# Altium project MD015A.PrjPcb (part 1 of 3)
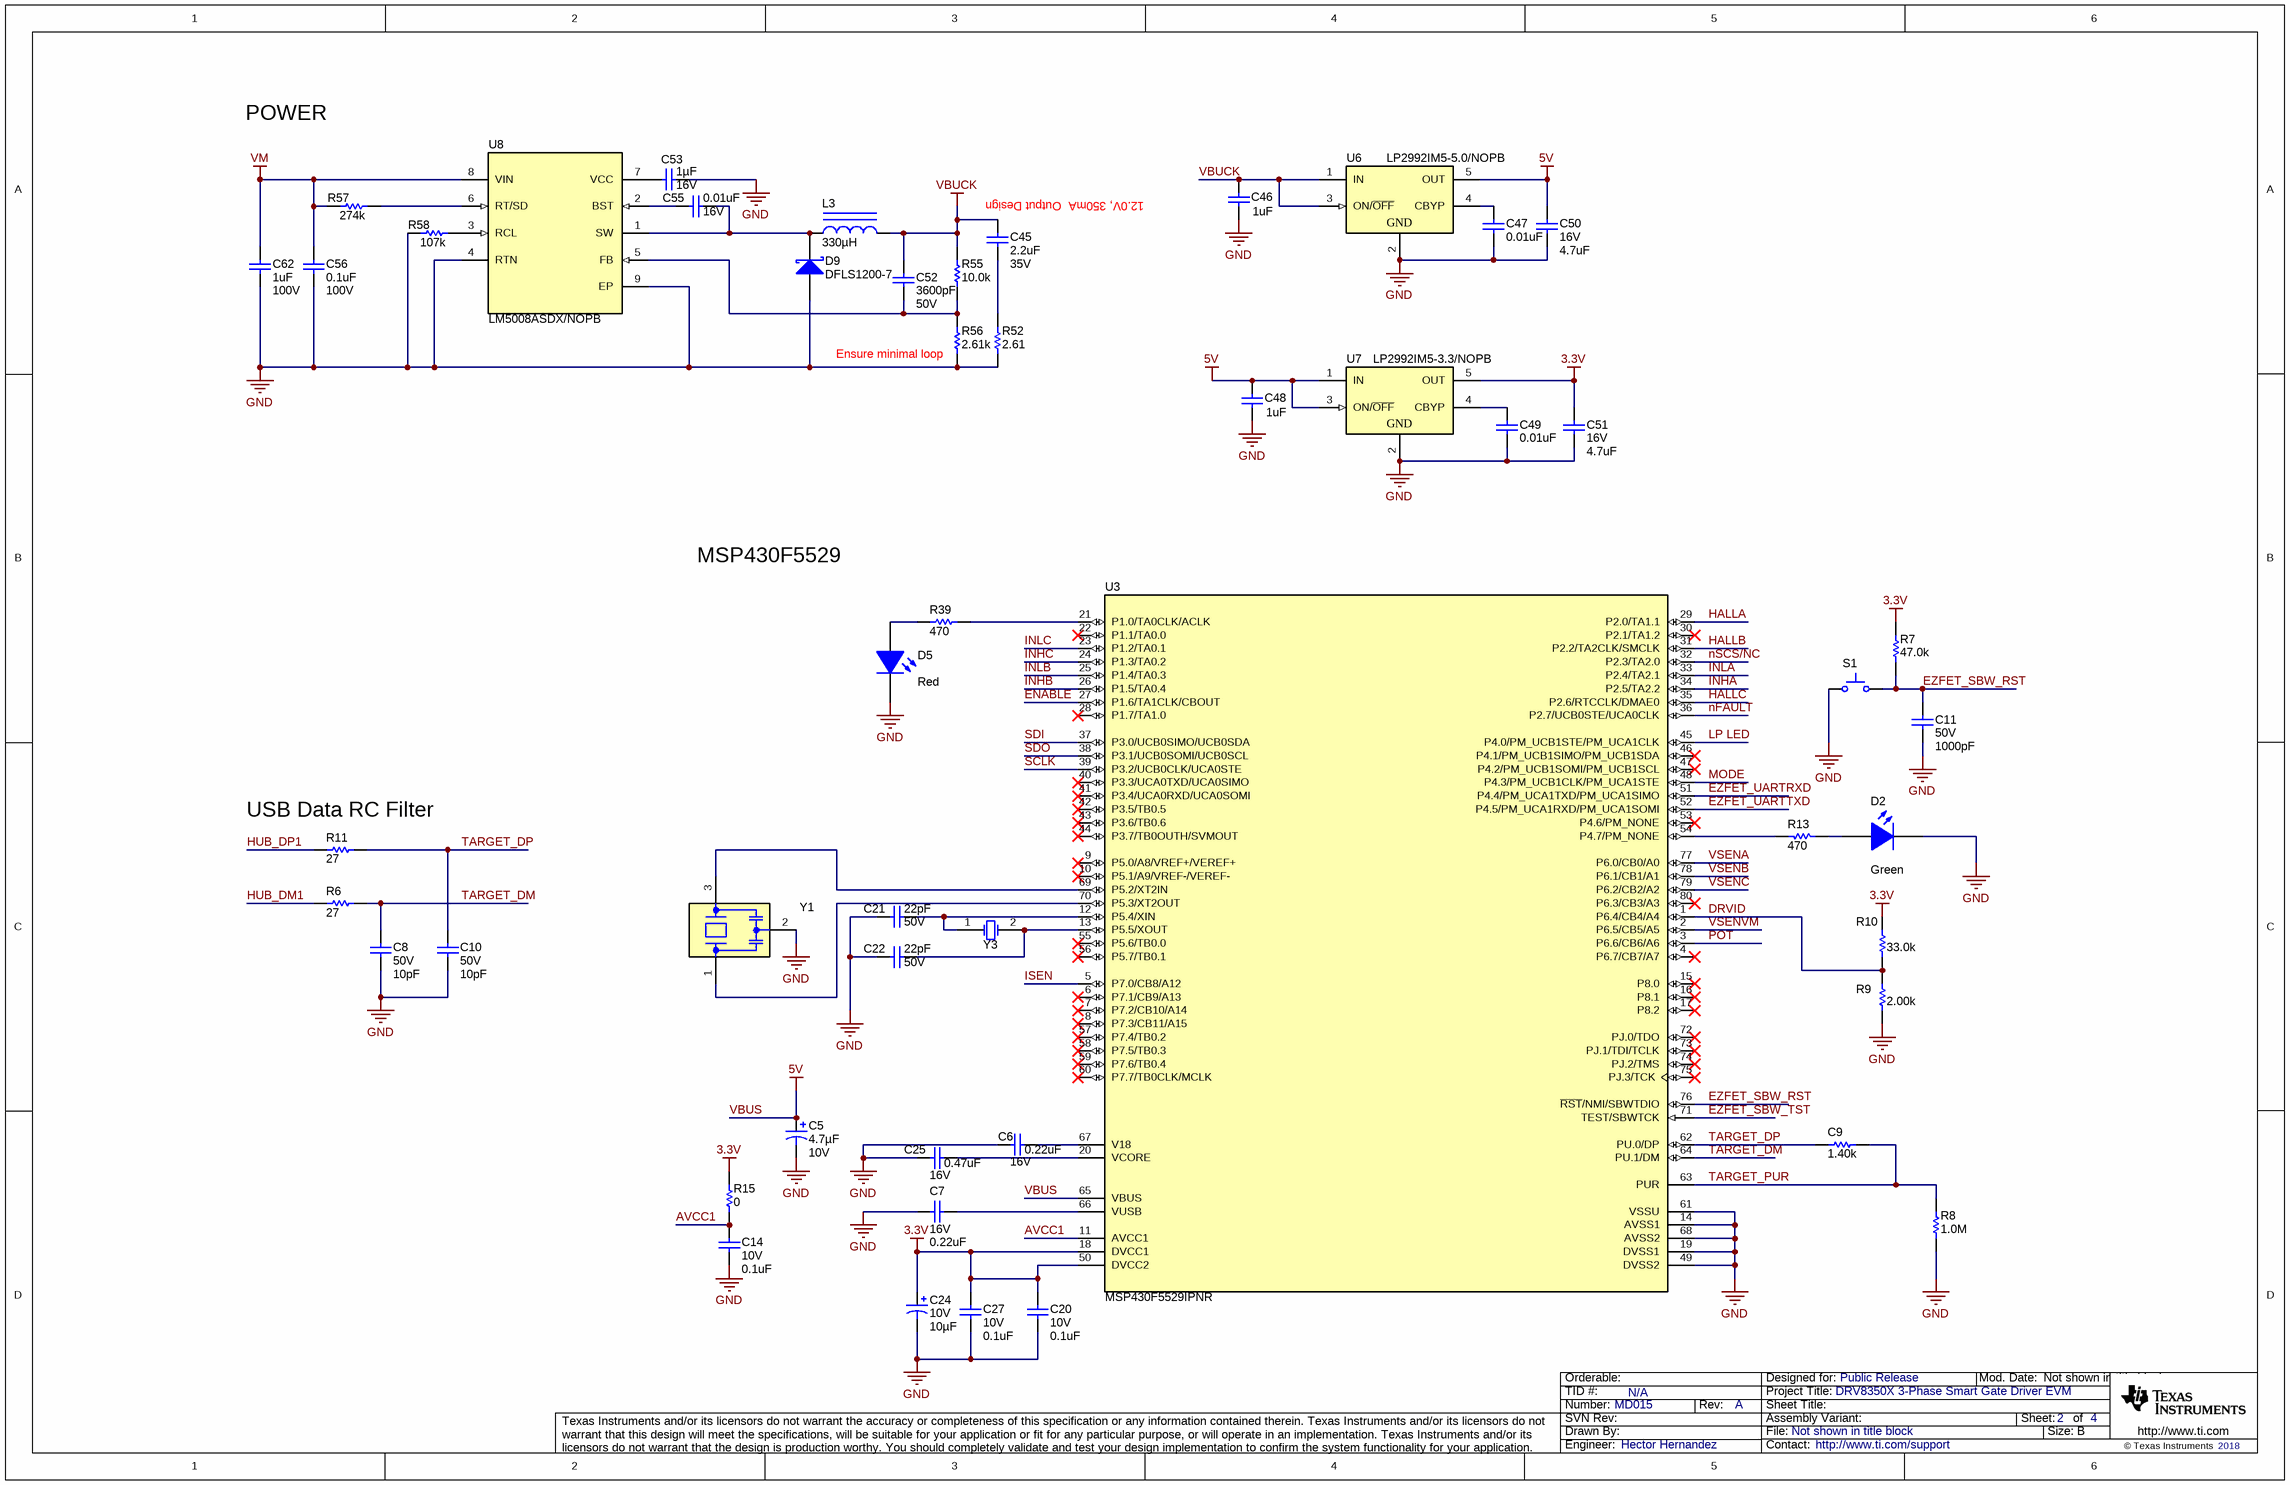
[diagram p0: MD015A_MCU_F5529.SchDoc]
CopyrightYear: 2018; PCB_Layout: Hector Hernandez; PCB_Rev: A; PRJ_Customer: Public Release; PRJ_Engineer: Hector Hernandez; PRJ_Number: MD015; PRJ_Title: DRV8350X 3-Phase Smart Gate Driver EVM; SCH_Rev: A; TechSupport: http://www.ti.com/support; TID: N/A
4 sheets, 249 parts. Net scope: global (net labels, ports and power ports of the same name join across sheets).
Board file: MD015A.PcbDoc
Sheets:
  MD015A_MCU_F5529.SchDoc
  MD015A_Hardware.SchDoc
  MD015A.SchDoc
  MD015A_MCU_USB2HUB.SchDoc

## Sheet MD015A_MCU_F5529.SchDoc
size 431 x 279 mm; Date: Not shown in title block; ApprovedBy: Not shown in title block; CheckedBy: Not shown in title block; Author: Not shown in title block; CompanyName: Not shown in title block; Engineer: Not shown in title block; Organization: Not shown in title block; Address1: Not shown in title block; Address2: Not shown in title block; Address3: Not shown in title block; Address4: Not shown in title block; DocumentNumber: 2; Revision: Use project parameter SCH_Rev; SheetNumber: 2; SheetTotal: 4; PageSetup: Record=PageOptions|CenterHorizontal=True|CenterVertical=True|PrintScale=1.00|XCorrection=1.00|YCorrection=1.00|PrintKind=0|BorderSize=5000000|LeftOffset=0|BottomOffset=0|Orientation=2|PaperLength=1000|PaperWidth=1000|Scale=100|PaperSource=15|PrintQuality=600|MediaType=1|DitherType=10|PaperKind=Letter|PrintScaleMode=1; CurrentTime: Not shown in title block; CurrentDate: Not shown in title block; Time: Not shown in title block; DocumentFullPathAndName: Not shown in title block; DocumentName: Not shown in title block; ModifiedDate: Not shown in title block; ImagePath: Not shown in title block

### Parts
C5  ValueDisplayed: 4.7µF  VDC_V: 10V  [3216-18]  (hidden comment: T55A475M010C0500)
C6  VDC_V: 16V  ValueDisplayed: 0.22uF  [0402L]  (hidden comment: C1005X5R1C224K050BB)
C7  VDC_V: 16V  ValueDisplayed: 0.22uF  [0402L]  (hidden comment: C1005X5R1C224K050BB)
C8  VDC_V: 50V  ValueDisplayed: 10pF  [0402L]  (hidden comment: 500R07S100JV4T)
C9  ValueDisplayed: 1.40k  [0402L]  (hidden comment: ERJ-2RKF1401X)
C10  VDC_V: 50V  ValueDisplayed: 10pF  [0402L]  (hidden comment: 500R07S100JV4T)
C11  VDC_V: 50V  ValueDisplayed: 1000pF  [0402L]  (hidden comment: 885012205061)
C14  VDC_V: 10V  ValueDisplayed: 0.1uF  [0402L]  (hidden comment: 885012105010)
C20  VDC_V: 10V  ValueDisplayed: 0.1uF  [0402L]  (hidden comment: 885012105010)
C21  VDC_V: 50V  ValueDisplayed: 22pF  [0402L]  (hidden comment: C1005C0G1H220J050BA)
C22  VDC_V: 50V  ValueDisplayed: 22pF  [0402L]  (hidden comment: C1005C0G1H220J050BA)
C24  VDC_V: 10V  ValueDisplayed: 10µF  [3216-18]  (hidden comment: T520A106M010ATE080)
C25  VDC_V: 16V  ValueDisplayed: 0.47uF  [0603L]  (hidden comment: GCM188R71C474KA55D)
C27  VDC_V: 10V  ValueDisplayed: 0.1uF  [0402L]  (hidden comment: 885012105010)
C45  ValueDisplayed: 2.2uF  VDC_V: 35V  [0805L]  (hidden comment: C2012X7R1V225K085AC)
C46  ValueDisplayed: 1uF  [0805L]  (hidden comment: CL21B105KBFNNNE)
C47  ValueDisplayed: 0.01uF  [0603L]  (hidden comment: C0603C103K4RACTU)
C48  ValueDisplayed: 1uF  [0805L]  (hidden comment: CL21B105KBFNNNE)
C49  ValueDisplayed: 0.01uF  [0603L]  (hidden comment: C0603C103K4RACTU)
C50  VDC_V: 16V  ValueDisplayed: 4.7uF  [0805L]  (hidden comment: GRM21BR71C475KA73L)
C51  VDC_V: 16V  ValueDisplayed: 4.7uF  [0805L]  (hidden comment: GRM21BR71C475KA73L)
C52  ValueDisplayed: 3600pF  VDC_V: 50V  [0603L]  (hidden comment: GRM1885C1H362JA01D)
C53  VDC_V: 16V  ValueDisplayed: 1µF  [0603]  (hidden comment: CL10B105KO8VPNC)
C55  ValueDisplayed: 0.01uF  VDC_V: 16V  [0603L]  (hidden comment: C0603C103K4RACTU)
C56  ValueDisplayed: 0.1uF  VDC_V: 100V  [0805_HV]  (hidden comment: C2012X7R2A104K125AA)
C62  ValueDisplayed: 1uF  VDC_V: 100V  [1206_180]  (hidden comment: CL31B105KCHNNNE)
D2  value Green  [LED_LTST-C190]  (hidden comment: LTST-C190GKT)
D5  value Red  [LED_LTST-C190_Red]  (hidden comment: LTST-C190CKT)
D9  DFLS1200-7  [PowerDI123]
L3  ValueDisplayed: 330µH  [WE-LQS_8040]  (hidden comment: 74404084331)
R6  ValueDisplayed: 27  [0402L]  (hidden comment: CRCW040227R0JNED)
R7  ValueDisplayed: 47.0k  [0402L]  (hidden comment: RC0402FR-0747KL)
R8  ValueDisplayed: 1.0M  [0402L]  (hidden comment: CRCW04021M00JNED)
R9  ValueDisplayed: 2.00k  [0603L]  (hidden comment: RC0603FR-072KL)
R10  ValueDisplayed: 33.0k  [0603L]  (hidden comment: MCT06030C3302FP500)
R11  ValueDisplayed: 27  [0402L]  (hidden comment: CRCW040227R0JNED)
R13  ValueDisplayed: 470  [0402L]  (hidden comment: ERJ-2RKF4700X)
R15  ValueDisplayed: 0  [0402L]  (hidden comment: MCR01MZPJ000)
R39  ValueDisplayed: 470  [0402L]  (hidden comment: ERJ-2RKF4700X)
R52  ValueDisplayed: 2.61  [0603L]  (hidden comment: CRCW06032R61FKEA)
R55  ValueDisplayed: 10.0k  [0603L]  (hidden comment: RG1608P-103-B-T5)
R56  ValueDisplayed: 2.61k  [0603L]  (hidden comment: RG1608P-2611-B-T5)
R57  ValueDisplayed: 274k  [0603_HV]  (hidden comment: RC0603FR-07274KL)
R58  ValueDisplayed: 107k  [0603_HV]  (hidden comment: RC0603FR-07107KL)
S1  EVQ-21505R  [SW_EVQ-21x05]  (value not drawn)
U3  MSP430F5529IPNR  [PN0080A_L]
U6  LP2992IM5-5.0/NOPB  [DBV0005A_L]
U7  LP2992IM5-3.3/NOPB  [DBV0005A_L]
U8  LM5008ASDX/NOPB  [NGU0008B]
Y1  CSTNR4M00GH5L000R0  [MuRata_CSTNR]  (value not drawn)
Y3  FC-135R 32.7680KA-A3  [Epson_FC-135]  (value not drawn)

### Nets
3.3V: C20.2 C24.1(+) C27.2 C51.1 R7.2 R10.2 R15.2 U3.18(DVCC1) U3.50(DVCC2) U7.5(OUT)
GND: C5.2(-) C6.1 C7.1 C8.1 C10.1 C11.2 C14.2 C20.1 C21.1 C22.1 C24.2(-) C25.1 C27.1 C46.2 C47.2 C48.2 C49.2 C50.2 C51.2 C53.2 C56.2 C62.2 D2.2(K) D5.2(K) D9.2(A) R8.1 R9.1 R52.1 R56.1 R58.1 S1.1 U3.14(AVSS1) U3.19(DVSS1) U3.49(DVSS2) U3.61(VSSU) U3.68(AVSS2) U6.2(GND) U7.2(GND) U8.4(RTN) U8.9(EP) Y1.2(GND)
VBUCK: C45.1 C46.1 C52.1 L3.2 R55.2 U6.1(IN) U6.3(ON/~{OFF})
VBUS: C5.1(+) C48.1 C50.1 U3.65(VBUS) U6.5(OUT) U7.1(IN) U7.3(ON/~{OFF})  [also labelled 5V]
VM: C56.1 C62.1 R57.1 U8.8(VIN)
AVCC1: C14.1 R15.1 U3.11(AVCC1)
DRVID: R9.2 R10.1 U3.1(P6.4/CB4/A4)
ENABLE: U3.27(P1.6/TA1CLK/CBOUT)
EZFET_SBW_RST: C11.1 R7.1 S1.2 U3.76(~{RST}/NMI/SBWTDIO)
EZFET_SBW_TST: U3.71(TEST/SBWTCK)
EZFET_UARTRXD: U3.51(P4.4/PM_UCA1TXD/PM_UCA1SIMO)
EZFET_UARTTXD: U3.52(P4.5/PM_UCA1RXD/PM_UCA1SOMI)
HALLA: U3.29(P2.0/TA1.1)
HALLB: U3.31(P2.2/TA2CLK/SMCLK)
HALLC: U3.35(P2.6/RTCCLK/DMAE0)
HUB_DM1: R6.2
HUB_DP1: R11.2
INHA: U3.34(P2.5/TA2.2)
INHB: U3.26(P1.5/TA0.4)
INHC: U3.24(P1.3/TA0.2)
INLA: U3.33(P2.4/TA2.1)
INLB: U3.25(P1.4/TA0.3)
INLC: U3.23(P1.2/TA0.1)
ISEN: U3.5(P7.0/CB8/A12)
LP LED: U3.45(P4.0/PM_UCB1STE/PM_UCA1CLK)
MODE: U3.48(P4.3/PM_UCB1CLK/PM_UCA1STE)
nFAULT: U3.36(P2.7/UCB0STE/UCA0CLK)
nSCS/NC: U3.32(P2.3/TA2.0)
POT: U3.3(P6.6/CB6/A6)
SCLK: U3.39(P3.2/UCB0CLK/UCA0STE)
SDI: U3.37(P3.0/UCB0SIMO/UCB0SDA)
SDO: U3.38(P3.1/UCB0SOMI/UCB0SCL)
TARGET_DM: C8.2 R6.1 U3.64(PU.1/DM)
TARGET_DP: C9.1 C10.2 R11.1 U3.62(PU.0/DP)
TARGET_PUR: C9.2 R8.2 U3.63(PUR)
VSENA: U3.77(P6.0/CB0/A0)
VSENB: U3.78(P6.1/CB1/A1)
VSENC: U3.79(P6.2/CB2/A2)
VSENVM: U3.2(P6.5/CB5/A5)
NetC6_2: C6.2 U3.67(V18)
NetC7_2: C7.2 U3.66(VUSB)
NetC21_2: C21.2 U3.12(P5.4/XIN) Y3.1(OSC1)
NetC22_2: C22.2 U3.13(P5.5/XOUT) Y3.2(OSC2)
NetC25_2: C25.2 U3.20(VCORE)
NetC45_2: C45.2 R52.2
NetC47_1: C47.1 U6.4(CBYP)
NetC49_1: C49.1 U7.4(CBYP)
NetC52_2: C52.2 R55.1 R56.2 U8.5(FB)
NetC53_1: C53.1 U8.7(VCC)
NetC55_1: C55.1 D9.1(K) L3.1 U8.1(SW)
NetC55_2: C55.2 U8.2(BST)
NetD2_1: D2.1(A) R13.2
NetD5_1: D5.1(A) R39.2
NetR13_1: R13.1 U3.54(P4.7/PM_NONE)
NetR39_1: R39.1 U3.21(P1.0/TA0CLK/ACLK)
NetR57_2: R57.2 U8.6(RT/SD)
NetR58_2: R58.2 U8.3(RCL)
NetU3_69: U3.69(P5.2/XT2IN) Y1.3(Out)
NetU3_70: U3.70(P5.3/XT2OUT) Y1.1(In)

Not connected (* = marked no-connect by the designer): U3 4(P6.7/CB7/A7)* 6(P7.1/CB9/A13)* 7(P7.2/CB10/A14)* 8(P7.3/CB11/A15)* 9(P5.0/A8/VREF+/VEREF+)* 10(P5.1/A9/VREF-/VEREF-)* 15(P8.0)* 16(P8.1)* 17(P8.2)* 22(P1.1/TA0.0)* 28(P1.7/TA1.0)* 30(P2.1/TA1.2)* 40(P3.3/UCA0TXD/UCA0SIMO)* 41(P3.4/UCA0RXD/UCA0SOMI)* 42(P3.5/TB0.5)* 43(P3.6/TB0.6)* 44(P3.7/TB0OUTH/SVMOUT)* 46(P4.1/PM_UCB1SIMO/PM_UCB1SDA)* 47(P4.2/PM_UCB1SOMI/PM_UCB1SCL)* 53(P4.6/PM_NONE)* 55(P5.6/TB0.0)* 56(P5.7/TB0.1)* 57(P7.4/TB0.2)* 58(P7.5/TB0.3)* 59(P7.6/TB0.4)* 60(P7.7/TB0CLK/MCLK)* 72(PJ.0/TDO)* 73(PJ.1/TDI/TCLK)* 74(PJ.2/TMS)* 75(PJ.3/TCK)* 80(P6.3/CB3/A3)*

### Notes on the sheet
- POWER
- (near C45) 12.0V, 350mA  Output Design
- (near R56) Ensure minimal loop
- MSP430F5529
- (near R11) USB Data RC Filter
- Drawn By:
- SVN Rev:
- Number:
- TID #:
- Orderable:
- Rev:
- Sheet Title:
- File:
- Project Title:
- Designed for:
- Assembly Variant:
- Mod. Date:
- Sheet:
- Size:
- of
- B
- http://www.ti.com
- Texas Instruments and/or its licensors do not warrant the accuracy or completeness of this specification or any information contained therein. Texas Instruments and/or its licensors do not warrant that this design will meet the specifications, will be suitable for your application or fit for any particular purpose, or will operate in an implementation. Texas Instruments and/or its licensors do not warrant that the design is production worthy. You should completely validate and test your design implementation to confirm the system functionality for your application.
- Engineer:
- Contact:
- © Texas Instruments

### Library data of the parts
C5 = CMP-0084377-1: CAP, Tantalum Polymer, 4.7 µF, 10 V,+/- 20%, 0.5 ohm, 3216-18 SMD; Manufacturer: Vishay-Sprague; Value1: 0.5 ohm; SizeX_mm: 3.2; AEC Qualified: N; ESR_ohm: 0.5; SizeAreaWB_mm2: 10.92; SizeZ_mm: 1.8; TaMax_C: 105°C; TaMin_C: -55°C; SizeY_mm: 1.6; Polarized: Y; CompType: Capacitor; SizeArea_mm2: 5.12; Value: 4.7uF; AEC Category: Q200; Cap_F: 4.7µF; PackageReference: 3216-18; Series: ?; MountType: SMT; Tolerance_%: 20%; AEC Grade: N/A; Cap_Case: 3216-18; RoHS: Y; ComponentLink1Description: Datasheet link; Technology: Tantalum Polymer; ComponentLink1URL: http://www.vishay.com/docs/40174/t55.pdf; PartNumber: T55A475M010C0500; Value2: 10V
C6 C7 = CMP-0006274-2: CAP, CERM, 0.22 uF, 16 V, +/- 10%, X5R, 0402; Manufacturer: TDK; TaMin_C: -55°C; Polarized: N; SizeAreaWB_mm2: 3; Value1: Unknown; U/M: EA; Value: 0.22uF; TaMax_C: 85°C; SizeZ_mm: 0.6; SizeX_mm: 1; SizeY_mm: 0.5; Cap_Case: 0402; Cap_F: 220nF; AEC Category: Q200; Supplier Part Number 2: 90R7592; Publisher: Texas Instruments; Supplier 2: Newark; Supplier Part Number 3: 810-C1005X5R1C224K; TempCo: X5R; Supplier 3: Mouser; Published: 2008-06-19; RoHS: Y; MountType: SMT; Supplier 1: Digi-Key; PackageReference: 0402; Tolerance_%: 10%; Value2: 16V; SizeArea_mm2: 0.5; CompType: Capacitor; LatestRevisionDate: 2017-03-09; PartNumber: C1005X5R1C224K050BB; AEC Qualified: N; ComponentLink1Description: Datasheet link; AEC Grade: N/A; Supplier Part Number 1: 445-4972-1-ND; Technology: Ceramic; ComponentLink1URL: https://product.tdk.com/info/en/documents/chara_sheet/C1005X5R1C224K050BB.pdf
C8 C10 = CMP-0006207-2: CAP, CERM, 10 pF, 50 V, +/- 5%, C0G/NP0, 0402; Manufacturer: Johanson Technology; TaMin_C: -55°C; Polarized: N; SizeAreaWB_mm2: 3; Value1: Unknown; U/M: EA; Value: 10pF; TaMax_C: 125°C; SizeZ_mm: 0.6; SizeX_mm: 1; SizeY_mm: 0.5; Cap_Case: 0402; AEC Category: Q200; Publisher: Texas Instruments; TempCo: C0G/NP0; Published: 2008-06-19; RoHS: Y; MountType: SMT; PackageReference: 0402; Tolerance_%: 5%; Value2: 50V; SizeArea_mm2: 0.5; CompType: Capacitor; LatestRevisionDate: 2017-03-09; PartNumber: 500R07S100JV4T; AEC Qualified: ?; Cap_F: 10pF; ComponentLink1Description: Datasheet link; Technology: Ceramic; ComponentLink1URL: http://www.johansontechnology.com/images/stories/catalog/JTI_CAT_2012_MLCC_HighQ.pdf
C9 = CMP-0026666-1: RES, 1.40 k, 1%, 0.1 W, 0402; Manufacturer: Panasonic; Power_W: 100mW; TempCo: 100 ppm/C; Value_Code: 1k40; U/M: EA; Value: 1.40k; EIA_Code: E96; Res_ohm: 1.4k; SizeX_mm: 1; SizeY_mm: 0.5; SizeZ_mm: 0.6; Value2: 0.1W; VDC_V: 50V; AEC Category: Q200; ComponentLink1URL: http://industrial.panasonic.com/www-data/pdf/AOA0000/AOA0000CE2.pdf; Supplier Part Number 2: 51W8930; Publisher: Texas Instruments; Supplier 2: Newark; Supplier Part Number 3: 667-ERJ-2RKF1401X; Supplier 3: Mouser; Published: 2008-06-26; RoHS: Y; Value1: 1%; MountType: SMT; Supplier 1: Digi-Key; PackageReference: 0402; Tolerance_%: 1%; SizeArea_mm2: 0.5; CompType: Resistor; LatestRevisionDate: 2017-03-09; PartNumber: ERJ-2RKF1401X; AEC Qualified: ?; ComponentLink1Description: Datasheet link; Supplier Part Number 1: P1.40KLCT-ND; Technology: Thick Film
C11 = CMP-0006231-2: CAP, CERM, 1000 pF, 50 V, +/- 10%, X7R, 0402; Manufacturer: Wurth Elektronik; TaMin_C: -55°C; Polarized: N; SizeAreaWB_mm2: 3; Value1: Unknown; U/M: EA; Value: 1000pF; TaMax_C: 125°C; SizeZ_mm: 0.6; SizeX_mm: 1; SizeY_mm: 0.5; Cap_Case: 0402; Cap_F: 1nF; AEC Category: Q200; Supplier Part Number 2: 710-885012205061; Publisher: Texas Instruments; Supplier 2: Mouser; TempCo: X7R; Published: 2008-06-19; RoHS: Y; MountType: SMT; Supplier 1: Digi-Key; PackageReference: 0402; Tolerance_%: 10%; Value2: 50V; SizeArea_mm2: 0.5; CompType: Capacitor; LatestRevisionDate: 2017-03-09; PartNumber: 885012205061; AEC Qualified: N; ComponentLink1Description: Datasheet link; AEC Grade: N/A; Supplier Part Number 1: 732-7556-1-ND; Technology: Ceramic; ComponentLink1URL: http://katalog.we-online.de/pbs/datasheet/885012205061.pdf
C14 C20 C27 = CMP-0006221-2: CAP, CERM, 0.1 uF, 10 V, +/- 20%, X5R, 0402; Manufacturer: Wurth Elektronik; TaMin_C: -55°C; Polarized: N; SizeAreaWB_mm2: 3; Value1: Unknown; U/M: EA; Value: 0.1uF; TaMax_C: 85°C; SizeZ_mm: 0.6; SizeX_mm: 1; SizeY_mm: 0.5; Cap_Case: 0402; Cap_F: 100nF; AEC Category: Q200; Supplier Part Number 2: 710-885012105010; Publisher: Texas Instruments; Supplier 2: Mouser; TempCo: X5R; Published: 2008-06-19; RoHS: Y; MountType: SMT; Supplier 1: Digi-Key; PackageReference: 0402; Tolerance_%: 20%; Value2: 10V; SizeArea_mm2: 0.5; CompType: Capacitor; LatestRevisionDate: 2017-03-09; PartNumber: 885012105010; AEC Qualified: N; ComponentLink1Description: Datasheet link; AEC Grade: N/A; Supplier Part Number 1: 732-7487-1-ND; Technology: Ceramic; ComponentLink1URL: http://katalog.we-online.de/pbs/datasheet/885012105010.pdf
C21 C22 = CMP-0006248-2: CAP, CERM, 22 pF, 50 V, +/- 5%, C0G/NP0, 0402; Manufacturer: TDK; TaMin_C: -55°C; Polarized: N; SizeAreaWB_mm2: 3; Value1: Unknown; U/M: EA; Value: 22pF; TaMax_C: 125°C; SizeZ_mm: 0.6; SizeX_mm: 1; SizeY_mm: 0.5; Cap_Case: 0402; AEC Category: Q200; Supplier Part Number 2: 55T0064; Publisher: Texas Instruments; Supplier 2: Newark; Supplier Part Number 3: 810-C1005C0G1H220J; TempCo: C0G/NP0; Supplier 3: Mouser; Published: 2008-06-19; RoHS: Y; MountType: SMT; Supplier 1: Digi-Key; PackageReference: 0402; Tolerance_%: 5%; Value2: 50V; SizeArea_mm2: 0.5; CompType: Capacitor; LatestRevisionDate: 2017-03-09; PartNumber: C1005C0G1H220J050BA; AEC Qualified: ?; Cap_F: 22pF; ComponentLink1Description: Datasheet link; Supplier Part Number 1: 445-1239-1-ND; Technology: Ceramic; ComponentLink1URL: http://product.tdk.com/en/catalog/datasheets/mlcc_commercial_general_en.pdf
C24 = CMP-0084376-1: CAP, Tantalum Polymer, 10 µF, 10 V,+/- 20%, 0.08 ohm, 3216-18 SMD; Manufacturer: Kemet; TaMin_C: -55°C; SizeArea_mm2: 5.12; Value: 10uF; SizeAreaWB_mm2: 10.92; SizeY_mm: 1.6; Polarized: Y; SizeX_mm: 3.2; AEC Qualified: N; TaMax_C: 105°C; SizeZ_mm: 1.8; ESR_ohm: 0.08; CompType: Capacitor; AEC Category: Q200; PackageReference: 3216-18; Technology: Tantalum Polymer; Cap_Case: 3216-18; ComponentLink1URL: https://content.kemet.com/datasheets/KEM_T2076_T52X-530.pdf; ComponentLink1Description: Datasheet link; PartNumber: T520A106M010ATE080; Value1: 0.08 ohm; MountType: SMT; Value2: 10V; Cap_F: 10µF; RoHS: Y; Series: T520; Tolerance_%: 20%; AEC Grade: N/A
C25 = CMP-0007138-4: CAP, CERM, 0.47 uF, 16 V, +/- 10%, X7R, AEC-Q200 Grade 1, 0603; Manufacturer: MuRata; TaMin_C: -55°C; Polarized: N; SizeAreaWB_mm2: 4.68; Value1: Unknown; U/M: EA; Value: 0.47uF; TaMax_C: 125°C; SizeZ_mm: 1; SizeX_mm: 1.6; SizeY_mm: 0.8; Cap_Case: 0603; SizeArea_mm2: 1.28; AEC Qualified: Y; Cap_F: 470nF; AEC Category: Q200; Supplier Part Number 2: 45Y5163; Publisher: Texas Instruments; Supplier 2: Newark; TempCo: X7R; Published: 2008-06-19; RoHS: Y; MountType: SMT; Supplier 1: Digi-Key; PackageReference: 0603; Tolerance_%: 10%; Value2: 16V; CompType: Capacitor; LatestRevisionDate: 2017-03-09; PartNumber: GCM188R71C474KA55D; ComponentLink1Description: Datasheet link; AEC Grade: 1; Supplier Part Number 1: 490-4775-1-ND; Technology: Ceramic; ComponentLink1URL: http://psearch.en.murata.com/capacitor/product/GCM188R71C474KA55%23.pdf
C45 = CMP-0007883-2: CAP, CERM, 2.2 uF, 35 V, +/- 10%, X7R, 0805; Manufacturer: TDK; TaMin_C: -55°C; Polarized: N; SizeAreaWB_mm2: 6.75; Value1: Unknown; U/M: EA; Value: 2.2uF; TaMax_C: 125°C; SizeZ_mm: 1.45; SizeX_mm: 2; SizeY_mm: 1.25; Cap_Case: 0805; SizeArea_mm2: 2.5; Cap_F: 2.2µF; AEC Category: Q200; Supplier Part Number 2: 52X4254; Publisher: Texas Instruments; Supplier 2: Newark; TempCo: X7R; Published: 2008-06-19; RoHS: Y; MountType: SMT; Supplier 1: Digi-Key; PackageReference: 0805; Tolerance_%: 10%; Value2: 35V; CompType: Capacitor; LatestRevisionDate: 2017-03-09; PartNumber: C2012X7R1V225K085AC; AEC Qualified: ?; ComponentLink1Description: Datasheet link; Supplier Part Number 1: 445-14547-1-ND; Technology: Ceramic; ComponentLink1URL: http://product.tdk.com/en/catalog/datasheets/mlcc_commercial_general_en.pdf
C46 C48 = CMP-0007994-2: CAP, CERM, 1 uF, 50 V, +/- 10%, X7R, 0805; Manufacturer: Samsung Electro-Mechanics; TaMin_C: -55°C; Polarized: N; SizeAreaWB_mm2: 6.75; Value1: Unknown; U/M: EA; Value: 1uF; TaMax_C: 125°C; SizeZ_mm: 1.45; SizeX_mm: 2; SizeY_mm: 1.25; Cap_Case: 0805; Value2: 50V; SizeArea_mm2: 2.5; CompType: Capacitor; Cap_F: 1µF; AEC Category: Q200; Publisher: Texas Instruments; TempCo: X7R; Published: 2008-06-19; RoHS: Y; MountType: SMT; PackageReference: 0805; Tolerance_%: 10%; LatestRevisionDate: 2017-03-09; PartNumber: CL21B105KBFNNNE; AEC Qualified: ?; ComponentLink1Description: Datasheet link; Technology: Ceramic; ComponentLink1URL: http://www.samsungsem.com/servlet/FileDownload?type=spec&file=CL21B105KBFNNNE.pdf
C47 C49 = CMP-0006853-4: CAP, CERM, 0.01 uF, 16 V, +/- 10%, X7R, 0603; Manufacturer: Kemet; Polarized: N; Value: 0.01uF; U/M: EA; Cap_F: 10nF; Value1: Unknown; VDC_V: 16V; TaMin_C: -55°C; TaMax_C: 125°C; Cap_Case: 0603; SizeArea_mm2: 1.28; SizeAreaWB_mm2: 4.68; SizeX_mm: 1.6; SizeY_mm: 0.8; SizeZ_mm: 1; AEC Category: Q200; CompType: Capacitor; PartNumber: C0603C103K4RACTU; PackageReference: 0603; RoHS: Y; Tolerance_%: 10%; Value2: 16V; MountType: SMT; Technology: Ceramic; TempCo: X7R; Published: 2008-06-19; Publisher: Texas Instruments; LatestRevisionDate: 2017-03-09; ComponentLink1Description: Datasheet link; ComponentLink1URL: http://www.kemet.com/docfinder?Partnumber=C0603C103K4RACTU; Supplier 1: Digi-Key; Supplier Part Number 1: 399-7841-1-ND; Supplier 2: Newark; Supplier Part Number 2: 90C0378; Supplier 3: Mouser; Supplier Part Number 3: 80-C0603C103K4R; AEC Qualified: N; AEC Grade: N/A
C50 C51 = CMP-0008334-2: CAP, CERM, 4.7 uF, 16 V, +/- 10%, X7R, 0805; Manufacturer: MuRata; TaMin_C: -55°C; ESR_ohm: 6m; Polarized: N; SizeAreaWB_mm2: 6.75; Value1: 0.006 ohm; U/M: EA; Value: 4.7uF; TaMax_C: 125°C; SizeZ_mm: 1.45; SizeX_mm: 2; SizeY_mm: 1.25; Cap_Case: 0805; SizeArea_mm2: 2.5; Cap_F: 4.7µF; AEC Category: Q200; ComponentLink1URL: http://search.murata.co.jp/Ceramy/PnsearchViewAction.do?HnOFG=ON&HnNFG=ON&SEL_CNT=50&sLang=en&sKey=GRM21BR71C475KA73L&x=9&y=9&search=startwith; Supplier Part Number 2: 81-GRM21BR71C475KA73; Publisher: Texas Instruments; Supplier 2: Mouser; Supplier Part Number 3: 1797015; TempCo: X7R; Supplier 3: Farnell; Published: 2008-06-19; RoHS: Y; MountType: SMT; Supplier 1: Digi-Key; PackageReference: 0805; Tolerance_%: 10%; Value2: 16V; CompType: Capacitor; LatestRevisionDate: 2017-03-09; PartNumber: GRM21BR71C475KA73L; AEC Qualified: ?; ComponentLink1Description: Datasheet link; Supplier Part Number 1: 490-4522-1-ND; Technology: Ceramic
C52 = CMP-0007213-4: CAP, CERM, 3600 pF, 50 V, +/- 5%, C0G/NP0, 0603; Manufacturer: MuRata; TaMin_C: -55°C; Polarized: N; SizeAreaWB_mm2: 4.68; Value1: Unknown; U/M: EA; Value: 3600pF; TaMax_C: 125°C; SizeZ_mm: 1; SizeX_mm: 1.6; SizeY_mm: 0.8; Cap_Case: 0603; SizeArea_mm2: 1.28; Cap_F: 3.6nF; AEC Category: Q200; Supplier Part Number 2: 81-GRM1885C1H362JA1D; Publisher: Texas Instruments; Supplier 2: Mouser; TempCo: C0G/NP0; Published: 2008-06-19; RoHS: Y; MountType: SMT; Supplier 1: Digi-Key; PackageReference: 0603; Tolerance_%: 5%; Value2: 50V; CompType: Capacitor; LatestRevisionDate: 2017-03-09; PartNumber: GRM1885C1H362JA01D; AEC Qualified: ?; ComponentLink1Description: Datasheet link; Supplier Part Number 1: GRM1885C1H362JA01D-ND; Technology: Ceramic; ComponentLink1URL: http://search.murata.co.jp/Ceramy/PnsearchViewAction.do?HnOFG=ON&HnNFG=ON&SEL_CNT=50&sLang=en&sKey=GRM1885C1H362JA01D&x=9&y=9&search=startwith
C53 = CMP-0085302-1: CAP, CERM, 1 µF, 16 V,+/- 10%, X7R, AEC-Q200 Grade 1, 0603; Manufacturer: Samsung Electro-Mechanics; TaMax_C: 125°C; AEC Grade: 1; SizeAreaWB_mm2: 4.68; AEC Category: Q200; SizeY_mm: 0.8; U/M: EA; SizeArea_mm2: 1.28; TaMin_C: -55°C; Value: 1uF; SizeX_mm: 1.6; AEC Qualified: Y; Polarized: N; PartNumber: CL10B105KO8VPNC; Tolerance_%: 10%; PackageReference: 0603; Value2: 16V; MountType: SMT; ComponentLink1URL: http://www.samsungsem.com/kr/support/product-search/mlcc/__icsFiles/afieldfile/2018/05/28/CL10B105KO8VPNC.pdf; SizeZ_mm: 1; Technology: Ceramic; Cap_Case: 0603; Cap_F: 1µF; CompType: Capacitor; RoHS: Y; ComponentLink1Description: Datasheet link; TempCo: X7R
C55 = CMP-0006853-4: CAP, CERM, 0.01 uF, 16 V, +/- 10%, X7R, 0603; Manufacturer: Kemet; TaMin_C: -55°C; Polarized: N; SizeAreaWB_mm2: 4.68; Value1: Unknown; U/M: EA; Value: 0.01uF; TaMax_C: 125°C; SizeZ_mm: 1; SizeX_mm: 1.6; SizeY_mm: 0.8; Cap_Case: 0603; SizeArea_mm2: 1.28; Cap_F: 10nF; AEC Category: Q200; Supplier Part Number 2: 90C0378; Publisher: Texas Instruments; Supplier 2: Newark; Supplier Part Number 3: 80-C0603C103K4R; TempCo: X7R; Supplier 3: Mouser; Published: 2008-06-19; RoHS: Y; MountType: SMT; Supplier 1: Digi-Key; PackageReference: 0603; Tolerance_%: 10%; Value2: 16V; CompType: Capacitor; LatestRevisionDate: 2017-03-09; PartNumber: C0603C103K4RACTU; AEC Qualified: N; ComponentLink1Description: Datasheet link; AEC Grade: N/A; Supplier Part Number 1: 399-7841-1-ND; Technology: Ceramic; ComponentLink1URL: http://www.kemet.com/docfinder?Partnumber=C0603C103K4RACTU
C56 = CMP-0007886-2: CAP, CERM, 0.1 uF, 100 V, +/- 10%, X7R, 0805; Manufacturer: TDK; TaMin_C: -55°C; ESR_ohm: 0.020726; Polarized: N; SizeAreaWB_mm2: 6.75; Value1: 0.020726 ohm; U/M: EA; Value: 0.1uF; TaMax_C: 125°C; SizeZ_mm: 1.45; SizeX_mm: 2; SizeY_mm: 1.25; Cap_Case: 0805; SizeArea_mm2: 2.5; Cap_F: 100nF; IRMS_A: 1.456A; AEC Category: Q200; Supplier Part Number 2: 1844410; Publisher: Texas Instruments; Supplier 2: Farnell; TempCo: X7R; Published: 2008-06-19; RoHS: Y; MountType: SMT; Supplier 1: Digi-Key; PackageReference: 0805; Tolerance_%: 10%; Value2: 100V; CompType: Capacitor; LatestRevisionDate: 2017-03-09; PartNumber: C2012X7R2A104K125AA; AEC Qualified: N; ComponentLink1Description: Datasheet link; AEC Grade: N/A; Supplier Part Number 1: 445-1418-1-ND; Technology: Ceramic; ComponentLink1URL: https://product.tdk.com/en/search/capacitor/ceramic/mlcc/info?part_no=C2012X7R2A104K125AA
C62 = CMP-0008801-2: CAP, CERM, 1 uF, 100 V, +/- 10%, X7R, 1206; Manufacturer: Samsung; TaMin_C: -55°C; Polarized: N; SizeAreaWB_mm2: 10.92; Value1: Unknown; U/M: EA; Value: 1uF; TaMax_C: 125°C; SizeZ_mm: 1.8; SizeX_mm: 3.2; SizeY_mm: 1.6; Cap_Case: 1206; SizeArea_mm2: 5.12; Cap_F: 1µF; AEC Category: Q200; Publisher: Texas Instruments; TempCo: X7R; Published: 2008-06-19; RoHS: Y; MountType: SMT; Supplier 1: Digi-Key; PackageReference: 1206; Tolerance_%: 10%; Value2: 100V; CompType: Capacitor; LatestRevisionDate: 2017-03-09; PartNumber: CL31B105KCHNNNE; AEC Qualified: N; ComponentLink1Description: Datasheet link; AEC Grade: N/A; Supplier Part Number 1: 1276-1838-1-ND; Technology: Ceramic; ComponentLink1URL: http://www.samsungsem.com/kr/front/downloadcms.do?path=/kr/support/product-search/mlcc/__icsFiles/afieldfile/2014/11/05&fileName=C_CL31B105KCHNNNE.pdf
D2 = CMP-0002827-3: LED, Green, SMD; Manufacturer: Lite-On; Power_TotalModule: 100mW; Value2: 2.1V; Io_A: 20mA; Value1: 0.1W; ComponentLink1Description: Datasheet link; PackageReference: 1.6x0.8x0.8mm; CompType: LED; Type: ?; ComponentLink1URL: https://sps06.itg.ti.com/sites/KMS/crossdivteams/altium/docs/ComponentDatasheets/LTST-C190GKT.pdf; Color: green; Vf_V: 2.1V; PartNumber: LTST-C190GKT; RoHS: Y; MountType: SMT
D5 = CMP-0002842-2: LED, Red, SMD; Manufacturer: Lite-On; Power_TotalModule: 62.5mW; Value1: 0.0625W; Io_A: 20mA; Value2: 2V; Tjmax_C: 85°C; RoHS: Y; Type: ?; ComponentLink1URL: http://optoelectronics.liteon.com/en-us/api/DwonloadFileHandler.ashx?txtSpecNo=DS-22-98-0009&txtPartNo=LTST-C190CKT; PackageReference: Red LED, 1.6x0.8x0.8mm; PartNumber: LTST-C190CKT; MountType: SMT; ComponentLink1Description: Datasheet link; CompType: LED; Color: red; Vf_V: 2V
D9 = CMP-0028517-2: Diode, Schottky, 200 V, 1 A, PowerDI123; Manufacturer: Diodes Inc.; Io_A: 1A; Green_Lifecycle: Active; SizeAreaWB_mm2: 13.066; Vr_V: 200V; Green_REACh: Passed; TJmax_C: 175°C; Value: 200V; SizeZ_mm: 0.98; SizeX_mm: 3.7; SizeY_mm: 1.78; Vf_V: 850mV; Value2: 0.85V; SizeArea_mm2: 6.586; AEC Category: Q101; RJC_CperW: 7; ComponentLink1URL: http://www.diodes.com/datasheets/ds30628.pdf; RoHS: Y; Value1: 1A; MountType: SMT; Green_EU RoHS-2: Passed; Green_EU RoHS: Passed with Exemption; PackageReference: PowerDI123; CompType: Diode; Type: Schottky; PartNumber: DFLS1200-7; AEC Qualified: ?; ComponentLink1Description: Datasheet link
L3 = CMP-0080995-1: Inductor, Shielded, 330 µH, 0.66 A, 1.1245 ohm, SMD; Manufacturer: Wurth Elektronik; SizeAreaWB_mm2: 100; Irms: 0.66A @ 40C rise; SizeArea_mm2: 64; AEC Qualified: N; AEC Category: Q200; Value: 330uH; SizeZ_mm: 4.2; Imax_A: 660mA; SizeY_mm: 8; Value2: 0.66A; Isat: 0.9A @ 30% inductance drop; DCR_ohm: 1.1245; ComponentLink1Description: Datasheet link; RoHS: Y; Supplier 1: Digi-Key; PackageReference: 8x8mm; Technology: Shielded; Ind_H: 330µH; PartNumber: 74404084331; Supplier Part Number 2: 710-74404084331; Supplier 2: Mouser; AEC Grade: N/A; ComponentLink1URL: http://katalog.we-online.de/pbs/datasheet/74404084331.pdf; Value1: 1.1245 ohm; CompType: Inductor; MountType: SMT; Supplier Part Number 1: 732-7267-1-ND; Material: ?; SizeX_mm: 8
R6 R11 = CMP-0026888-3: RES, 27, 5%, 0.063 W, AEC-Q200 Grade 0, 0402; Manufacturer: Vishay-Dale; Power_W: 63mW; TempCo: 200 ppm/C; Value_Code: 27R0; Value: 27; EIA_Code: E24; SizeX_mm: 1; SizeY_mm: 0.5; SizeZ_mm: 0.6; Value2: 0.063W; AEC Qualified: Y; VDC_V: 50V; AEC Category: Q200; AEC Grade: 0; Supplier Part Number 2: 59M6721; Supplier 2: Newark; Supplier Part Number 3: 71-CRCW0402J-27-E3; Supplier 3: Mouser; RoHS: E; Value1: 5%; MountType: SMT; Supplier 1: Digi-Key; PackageReference: 0402; Tolerance_%: 5%; Res_ohm: 27; SizeArea_mm2: 0.5; CompType: Resistor; PartNumber: CRCW040227R0JNED; ComponentLink1Description: Datasheet link; Supplier Part Number 1: 541-27JCT-ND; Technology: Thick Film; ComponentLink1URL: http://www.vishay.com/docs/20035/dcrcwe3.pdf
R7 = CMP-0026737-1: RES, 47.0 k, 1%, 0.0625 W, 0402; Manufacturer: Yageo America; Power_W: 62.5mW; TempCo: 100 ppm/C; Value_Code: 47k0; U/M: EA; Value: 47.0k; Res_ohm: 47k; SizeX_mm: 1; SizeY_mm: 0.5; SizeZ_mm: 0.6; AEC Qualified: N; VDC_V: 50V; AEC Category: Q200; ComponentLink1URL: http://www.yageo.com/documents/recent/PYu-RC0402_51_RoHS_L_6_r.pdf; Supplier Part Number 2: 67R9937; Publisher: Texas Instruments; Supplier 2: Newark; Supplier Part Number 3: 603-RC0402FR-0747KL; Supplier 3: Mouser; Published: 2008-06-26; RoHS: Y; Value1: 1%; MountType: SMT; Supplier 1: Digi-Key; PackageReference: 0402; Tolerance_%: 1%; Value2: 0.0625W; SizeArea_mm2: 0.5; CompType: Resistor; LatestRevisionDate: 2017-03-09; PartNumber: RC0402FR-0747KL; ComponentLink1Description: Datasheet link; AEC Grade: N/A; Supplier Part Number 1: 311-47.0KLRCT-ND; Technology: Thick Film
R8 = CMP-0026859-2: RES, 1.0 M, 5%, 0.063 W, AEC-Q200 Grade 0, 0402; Manufacturer: Vishay-Dale; Power_W: 63mW; TempCo: 200 ppm/C; Value_Code: 1M00; Value: 1.0Meg; EIA_Code: E24; Res_ohm: 1M; SizeX_mm: 1; SizeY_mm: 0.5; SizeZ_mm: 0.6; Value2: 0.063W; AEC Qualified: Y; VDC_V: 50V; AEC Category: Q200; AEC Grade: 0; ComponentLink1URL: http://www.vishay.com/docs/20035/dcrcwe3.pdf; Supplier Part Number 2: 59M6694; Supplier 2: Newark; Supplier Part Number 3: 71-CRCW0402J-1M-E3; Supplier 3: Mouser; RoHS: E; Value1: 5%; MountType: SMT; Supplier 1: Digi-Key; PackageReference: 0402; Tolerance_%: 5%; SizeArea_mm2: 0.5; CompType: Resistor; PartNumber: CRCW04021M00JNED; ComponentLink1Description: Datasheet link; Supplier Part Number 1: 541-1.0MJCT-ND; Technology: Thick Film
R9 = CMP-0023000-5: RES, 2.00 k, 1%, 0.1 W, 0603; Manufacturer: Yageo; Power_W: 100mW; TempCo: 100 ppm/C; Value_Code: 2k00; Value: 2.00k; EIA_Code: E96; Res_ohm: 2k; SizeX_mm: 1.6; SizeY_mm: 0.8; SizeZ_mm: 1; Value2: 0.1W; SizeArea_mm2: 1.28; AEC Qualified: N; VDC_V: 75V; AEC Category: Q200; SizeAreaWB_mm2: 4.68; Supplier Part Number 2: 603-RC0603FR-072KL; Supplier 2: Mouser; Supplier Part Number 3: 1799328; Supplier 3: Farnell; RoHS: Y; Value1: 1%; MountType: SMT; Supplier 1: Digi-Key; PackageReference: 0603; Tolerance_%: 1%; CompType: Resistor; PartNumber: RC0603FR-072KL; ComponentLink1Description: Datasheet link; Supplier Part Number 1: 311-2.00KHRCT-ND; Technology: Thick Film; ComponentLink1URL: http://www.yageo.com/pdf/Pu-RC0603_51_PbFree_L_2.pdf; AEC Grade: N/A
R10 = CMP-0022734-3: RES, 33.0 k, 1%, 0.125 W, 0603; Manufacturer: Vishay/Beyschlag; Power_W: 125mW; TempCo: 50 ppm/C; Value_Code: 33k0; U/M: EA; Value: 33.0k; Res_ohm: 33k; SizeX_mm: 1.6; SizeY_mm: 0.8; SizeZ_mm: 1; Value2: 0.125W; SizeArea_mm2: 1.28; AEC Qualified: N; VDC_V: 75V; AEC Category: Q200; Supplier Part Number 2: 96Y9426; Publisher: Texas Instruments; Supplier 2: Newark; Supplier Part Number 3: 594-MCT06030C3302FP5; Supplier 3: Mouser; Published: 2008-06-26; RoHS: Y; Value1: 1%; MountType: SMT; Supplier 1: Digi-Key; PackageReference: 0603; Tolerance_%: 1%; CompType: Resistor; LatestRevisionDate: 2017-03-09; PartNumber: MCT06030C3302FP500; ComponentLink1Description: Datasheet link; AEC Grade: N/A; Supplier Part Number 1: MCT0603-33.0K-CFCT-ND; Technology: Thin Film; ComponentLink1URL: http://www.vishay.com/docs/28705/mcx0x0xpro.pdf
R13 R39 = CMP-0026699-1: RES, 470, 1%, 0.1 W, AEC-Q200 Grade 0, 0402; Manufacturer: Panasonic; Power_W: 100mW; TempCo: 100 ppm/C; Value_Code: 470R; U/M: EA; Value: 470; SizeX_mm: 1; SizeY_mm: 0.5; SizeZ_mm: 0.6; Value2: 0.1W; AEC Qualified: Y; VDC_V: 50V; AEC Grade: 0; AEC Category: Q200; ComponentLink1URL: http://industrial.panasonic.com/lecs/www-data/pdf/AOA0000/AOA0000CE2.pdf; Supplier Part Number 2: 667-ERJ-2RKF4700X; Publisher: Texas Instruments; Supplier 2: Mouser; Supplier Part Number 3: 2397145; Supplier 3: Farnell; Published: 2008-06-26; RoHS: Y; Value1: 1%; MountType: SMT; Supplier 1: Digi-Key; PackageReference: 0402; Tolerance_%: 1%; Res_ohm: 470; SizeArea_mm2: 0.5; CompType: Resistor; LatestRevisionDate: 2017-03-09; PartNumber: ERJ-2RKF4700X; ComponentLink1Description: Datasheet link; Supplier Part Number 1: P470LCT-ND; Technology: Thick Film
R15 = CMP-0027002-2: RES, 0, 5%, 0.063 W, 0402; Manufacturer: Rohm; Power_W: 63mW; TempCo: 500 ppm/C; Value_Code: 0000; U/M: EA; Value: 0; EIA_Code: E24; SizeX_mm: 1; SizeY_mm: 0.5; SizeZ_mm: 0.6; Value2: 0.063W; VDC_V: 50V; AEC Category: Q200; Publisher: Texas Instruments; Published: 2008-06-26; RoHS: Y; Value1: 5%; MountType: SMT; Supplier 1: Digi-Key; PackageReference: 0402; Tolerance_%: 5%; Res_ohm: 0; SizeArea_mm2: 0.5; CompType: Resistor; LatestRevisionDate: 2017-03-09; PartNumber: MCR01MZPJ000; AEC Qualified: ?; ComponentLink1Description: Datasheet link; Supplier Part Number 1: RHM0.0JCT-ND; Technology: Thick Film; ComponentLink1URL: http://www.rohm.com/products/databook/r/pdf/mcr01.pdf
R52 = CMP-0022313-4: RES, 2.61, 1%, 0.1 W, AEC-Q200 Grade 0, 0603; Manufacturer: Vishay-Dale; Power_W: 100mW; TempCo: 100 ppm/C; Value_Code: 2R61; Value: 2.61; EIA_Code: E96; SizeX_mm: 1.6; SizeY_mm: 0.8; SizeZ_mm: 1; Value2: 0.1W; SizeArea_mm2: 1.28; AEC Qualified: Y; VDC_V: 75V; AEC Category: Q200; AEC Grade: 0; Supplier Part Number 2: 71-CRCW06032R61FKEA; Supplier 2: Mouser; RoHS: E; Value1: 1%; MountType: SMT; Supplier 1: Digi-Key; PackageReference: 0603; Tolerance_%: 1%; Res_ohm: 2.61; CompType: Resistor; PartNumber: CRCW06032R61FKEA; ComponentLink1Description: Datasheet link; Supplier Part Number 1: 541-2.61HHCT-ND; Technology: Thick Film; ComponentLink1URL: http://www.vishay.com/docs/20035/dcrcwe3.pdf
R55 = CMP-0023404-3: RES, 10.0 k, 0.1%, 0.1 W, 0603; Manufacturer: Susumu Co Ltd; Power_W: 100mW; TempCo: 25 ppm/C; Value_Code: 10k0; U/M: EA; Value: 10.0k; EIA_Code: E192; Res_ohm: 10k; SizeX_mm: 1.6; SizeY_mm: 0.8; SizeZ_mm: 1; Value2: 0.1W; SizeArea_mm2: 1.28; VDC_V: 75V; AEC Category: Q200; Supplier Part Number 2: 754-RG1608P-103-B-T5; Publisher: Texas Instruments; Supplier 2: Mouser; Supplier Part Number 3: 1797079; Supplier 3: Farnell; Published: 2008-06-26; RoHS: Y; Value1: 0.1%; MountType: SMT; Supplier 1: Digi-Key; PackageReference: 0603; Tolerance_%: 0.1%; CompType: Resistor; LatestRevisionDate: 2017-03-09; PartNumber: RG1608P-103-B-T5; AEC Qualified: ?; ComponentLink1Description: Datasheet link; Supplier Part Number 1: RG16P10.0KBCT-ND; Technology: Metal Film; ComponentLink1URL: http://www.susumu.co.jp/english/pdf/products-j01-01.pdf
R56 = CMP-0023494-3: RES, 2.61 k, 0.1%, 0.1 W, 0603; Manufacturer: Susumu Co Ltd; Power_W: 100mW; TempCo: 25 ppm/C; Value_Code: 2k61; U/M: EA; Value: 2.61k; EIA_Code: E192; SizeX_mm: 1.6; SizeY_mm: 0.8; SizeZ_mm: 1; Value2: 0.1W; SizeArea_mm2: 1.28; VDC_V: 75V; AEC Category: Q200; Supplier Part Number 2: 754-RG1608P-2611-BT5; Publisher: Texas Instruments; Supplier 2: Mouser; Supplier Part Number 3: 1797144; Supplier 3: Farnell; Published: 2008-06-26; RoHS: Y; Value1: 0.1%; MountType: SMT; Supplier 1: Digi-Key; PackageReference: 0603; Tolerance_%: 0.1%; Res_ohm: 2.61k; CompType: Resistor; LatestRevisionDate: 2017-03-09; PartNumber: RG1608P-2611-B-T5; ComponentLink1Description: Datasheet link; Supplier Part Number 1: RG16P2.61KBCT-ND; Technology: Metal Film; AEC Qualified: ?; ComponentLink1URL: http://www.susumu.co.jp/english/pdf/products-j01-01.pdf
R57 = CMP-0022963-4: RES, 274 k, 1%, 0.1 W, 0603; Manufacturer: Yageo; Power_W: 100mW; TempCo: 100 ppm/C; Value: 274k; EIA_Code: E96; SizeX_mm: 1.6; SizeY_mm: 0.8; SizeZ_mm: 1; Value2: 0.1W; SizeArea_mm2: 1.28; AEC Qualified: N; VDC_V: 75V; AEC Category: Q200; SizeAreaWB_mm2: 4.68; ComponentLink1URL: http://www.yageo.com/pdf/Pu-RC0603_51_PbFree_L_2.pdf; Supplier Part Number 2: 603-RC0603FR-07274KL; Supplier 2: Mouser; Supplier Part Number 3: 9238298; Supplier 3: Farnell; Value_Code: 274k; RoHS: Y; Value1: 1%; MountType: SMT; Supplier 1: Digi-Key; PackageReference: 0603; Tolerance_%: 1%; Res_ohm: 274k; CompType: Resistor; PartNumber: RC0603FR-07274KL; ComponentLink1Description: Datasheet link; Supplier Part Number 1: 311-274KHRCT-ND; Technology: Thick Film; AEC Grade: N/A
R58 = CMP-0022741-4: RES, 107 k, 1%, 0.1 W, 0603; Manufacturer: Yageo; Power_W: 100mW; TempCo: 100 ppm/C; Value: 107k; EIA_Code: E96; SizeX_mm: 1.6; SizeY_mm: 0.8; SizeZ_mm: 1; Value2: 0.1W; SizeArea_mm2: 1.28; AEC Qualified: N; VDC_V: 75V; AEC Category: Q200; SizeAreaWB_mm2: 4.68; ComponentLink1URL: http://www.yageo.com/pdf/Pu-RC0603_51_PbFree_L_2.pdf; Supplier Part Number 2: 603-RC0603FR-07107KL; Supplier 2: Mouser; Supplier Part Number 3: 9238247; Supplier 3: Farnell; Value_Code: 107k; RoHS: Y; Value1: 1%; MountType: SMT; Supplier 1: Digi-Key; PackageReference: 0603; Tolerance_%: 1%; Res_ohm: 107k; CompType: Resistor; PartNumber: RC0603FR-07107KL; ComponentLink1Description: Datasheet link; Supplier Part Number 1: 311-107KHRCT-ND; Technology: Thick Film; AEC Grade: N/A
S1 = CMP-0002172-2: Switch, Tactile, SPST-NO, 0.02A, 15V, TH; Manufacturer: Panasonic; CurrentRating_mA: 20A; PositionCount: 1; SwitchFunction: Off-Mom; Supplier 2: Newark; Supplier 3: Mouser; Supplier 1: Digi-Key; Supplier Part Number 1: P12225SCT-ND; Supplier Part Number 2: 52W2564; Supplier Part Number 3: 667-EVQ-21505R; PartNumber: EVQ-21505R; ComponentLink1Description: Datasheet URL; LatestRevisionDate: 2017-03-09; ComponentLink1URL: http://industrial.panasonic.com/www-data/pdf/ATK0000/ATK0000CE33.pdf; CompType: Switch; Publisher: Texas Instruments; Circuit: SPST-NO; VDC_V: 15V; RoHS: Y; Orientation: Top Actuated; PackageReference: 6.0x5.0x6mm; MountType: TH
U3 = CMP-0038966-1: 25 MHz Mixed Signal Microcontroller with 128 KB Flash, 8192 B SRAM and 63 GPIOs, -40 to 85 degC, 80-pin QFP (PN), Green (RoHS & no Sb/Br); Manufacturer: Texas Instruments; GPIO: 63; USCI_B (I2C & SPI): 2; Real-Time Clock: Yes; DMA: 3; SRAM(B): 8192; Frequency(MHz): 25; Flash(KB): 128; Multiplier: 32x32; ADC Channels: 16; SubFamily: 5 Series; ADC: 12-bit SAR; Timers - 16-bit: 4; USB: 1; Code_JEDEC: MS-018; Temp Sensor: Yes; ComponentLink2Description: Datasheet; DatasheetVersion: SLAS590I; Comparators: Yes; ComponentLink1URL: http://www.ti.com/; PackageDescription: 80-Pin Plastic Quad Flat Pack, Body 12 x 12 mm, Pitch 0.5 mm; ComponentLink2URL: http://www.ti.com/general/docs/lit/getliterature.tsp?genericPartNumber=MSP430F5529&fileType=pdf; PackageReference: PN0080A; ComponentLink1Description: Manufacturer URL; PartNumber: MSP430F5529IPNR; ComponentLink3URL: http://www.ti.com/lit/ml/mtqf010a/mtqf010a.pdf; Mounting Technology: Surface Mount; SVS: Yes; Eco-Plan: Green (RoHS & no Sb/Br); USCI_A (UART/LIN/IrDA/SPI): 2; Watchdog: Yes; Brown Out Reset: Yes; ComponentLink3Description: Package Specification
U6 = CMP-0070999-2: Micropower 250 mA Low-Noise Ultra Low-Dropout Regulator, DBV0005A (SOT-23-5); Manufacturer: Texas Instruments; CompType: IC; AEC Category: Q200; AEC Qualified: N; Rating: Catalog; SizeAreaWB_mm2: 14.82; SizeArea_mm2: 8.12; SizeX_mm: 2.8; SizeY_mm: 2.9; SizeZ_mm: 1.45; ComponentLink1Description: Datasheet Link; PackageDescription: SOT-23-5; RoHS: Y; ComponentLink1URL: http://www.ti.com/lit/ds/symlink/lp2992.pdf; PackageReference: DBV0005A; PartNumber: LP2992IM5-5.0/NOPB; ComponentLink2Description: Product Folder; ComponentLink2URL: http://www.ti.com/product/lp2992; ComponentLink3Description: Online Datasheet; ComponentLink3URL: http://www.ti.com/product/lp2992/datasheet; MountType: SMT; Operating Temperature Range: -40 to 125 C
U7 = CMP-0071001-2: Micropower 250 mA Low-Noise Ultra Low-Dropout Regulator, DBV0005A (SOT-23-5); Manufacturer: Texas Instruments; CompType: IC; AEC Category: Q200; AEC Qualified: N; Rating: Catalog; SizeAreaWB_mm2: 14.82; SizeArea_mm2: 8.12; SizeX_mm: 2.8; SizeY_mm: 2.9; SizeZ_mm: 1.45; RoHS: Y; PackageDescription: SOT-23-5; PackageReference: DBV0005A; ComponentLink1Description: Datasheet Link; ComponentLink1URL: http://www.ti.com/lit/ds/symlink/lp2992.pdf; PartNumber: LP2992IM5-3.3/NOPB; ComponentLink2Description: Product Folder; ComponentLink2URL: http://www.ti.com/product/lp2992; ComponentLink3Description: Online Datasheet; ComponentLink3URL: http://www.ti.com/product/lp2992/datasheet; MountType: SMT; Operating Temperature Range: -40 to 125 C
U8 = CMP-0072634-2: 100V, 350 mA Constant On-Time Buck Switching Regulator, 8-pin LLP, Pb-Free; Manufacturer: Texas Instruments; PackageTopMarking: NS*UZXYTT*L00070A; CompType: Switcher; PowerWise: N; High-Reliability: Y; ComponentLink1URL: http://www.ti.com/general/docs/lit/getliterature.tsp?genericPartNumber=LM5008A&fileType=pdf; PackageDescription: LLP, Dual, 4 x 4 x 0.8mm Body, 8 Lead, 0.8mm Pitch, No Pullback, 1.98 x 3mm Exposed Pad; PackageReference: NGU0008B; PinCount: 8; RoHS: Y; ComponentLink1Description: Datasheet URL; PartNumber: LM5008ASDX/NOPB
Y1 = CMP-0085483-1: Oscillator, 4 MHz, 700 ppm, 39 pF, SMD; Manufacturer: MuRata; SizeArea_mm2: 9; Load Capacitance: 39 pF; SizeZ_mm: 1.2; AEC Category: Q200; Frequency Tolerance: 700 ppm; SizeX_mm: 4.5; SizeAreaWB_mm2: 16.5; TaMax_C: 85°C; TaMin_C: -20°C; SizeY_mm: 2; AEC Qualified: N; Frequency_Fixed: 4MHz; CompType: Oscillator; ComponentLink1URL: https://www.murata.com/en-us/products/productdata/8802049818654/SPEC-CSTNR6M00GH5L000R0.pdf?1528293605000; RoHS: Y; MountType: SMT; PackageReference: 4.5x2mm; ComponentLink1Description: Datasheet Link; AEC Grade: N/A; PartNumber: CSTNR4M00GH5L000R0
Y3 = CMP-0085808-1: Crystal, 32.768 KHz, 20 ppm, 12.5 pF, AEC-Q200 Grade 3, SMD; Manufacturer: Epson; TaMin_C: -40°C; AEC Qualified: Y; Load Capacitance: 12.5 pF; TaMax_C: 85°C; Frequency Tolerance: 20 ppm; AEC Grade: 3; AEC Category: Q200; ComponentLink1Description: Datasheet Link; Frequency_Fixed: 32.768kHz; CompType: Crystal; PackageReference: SMD, 2-Leads, Body 3.2x1.5mm; PartNumber: FC-135R 32.7680KA-A3; ComponentLink1URL: https://support.epson.biz/td/api/doc_check.php?dl=brief_FC-135R&lang=en; MountType: SMT; RoHS: Y

## Sheet MD015A_Hardware.SchDoc
size 431 x 279 mm; Date: Not shown in title block; ApprovedBy: Not shown in title block; CheckedBy: Not shown in title block; Author: Not shown in title block; CompanyName: Not shown in title block; Engineer: Not shown in title block; Organization: Not shown in title block; Address1: Not shown in title block; Address2: Not shown in title block; Address3: Not shown in title block; Address4: Not shown in title block; DocumentNumber: 4; Revision: Use project parameter SCH_Rev; SheetNumber: 4; SheetTotal: 4; PageSetup: Record=PageOptions|CenterHorizontal=True|CenterVertical=True|PrintScale=1.00|XCorrection=1.00|YCorrection=1.00|PrintKind=0|BorderSize=5000000|LeftOffset=0|BottomOffset=0|Orientation=2|PaperLength=1000|PaperWidth=1000|Scale=100|PaperSource=15|PrintQuality=600|MediaType=1|DitherType=10|PaperKind=Letter|PrintScaleMode=1; CurrentTime: Not shown in title block; CurrentDate: Not shown in title block; Time: Not shown in title block; DocumentFullPathAndName: Not shown in title block; DocumentName: Not shown in title block; ModifiedDate: Not shown in title block; ImagePath: Not shown in title block
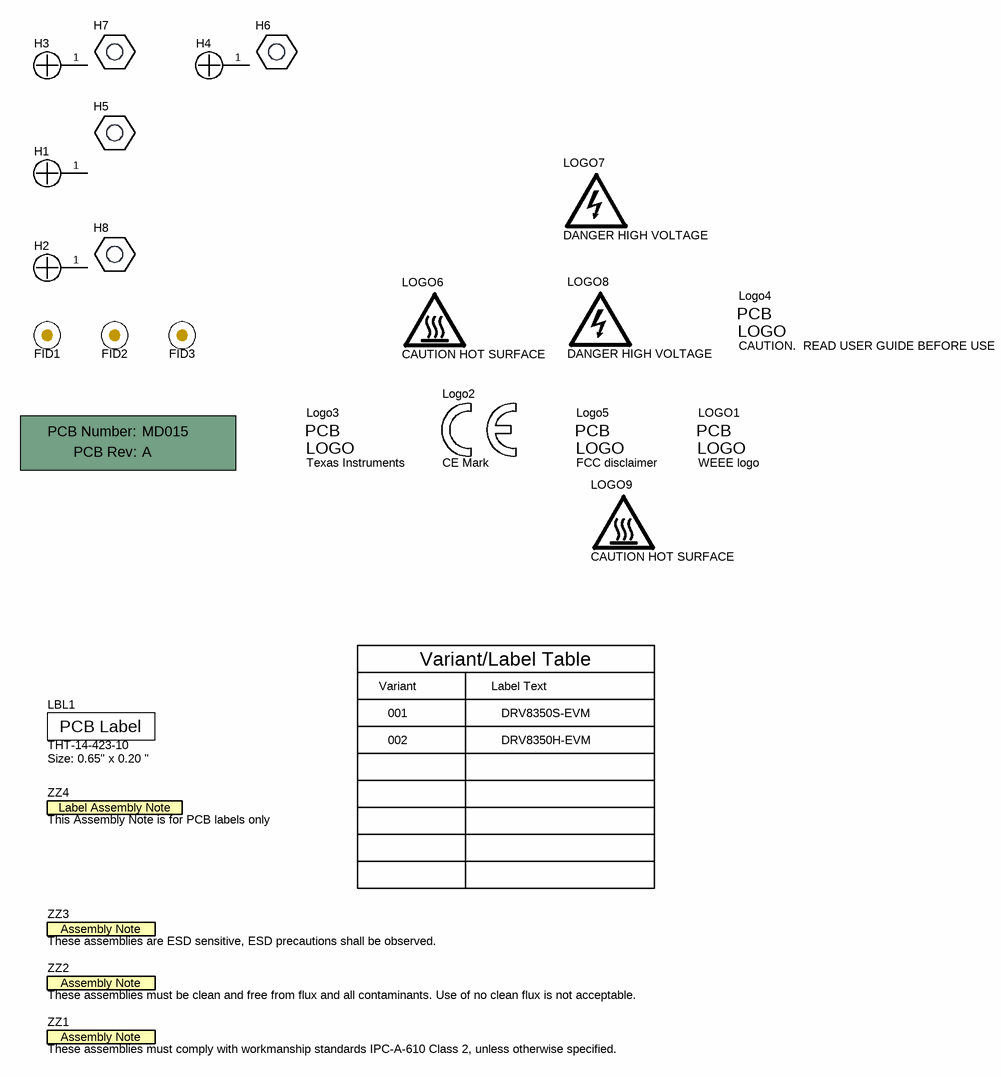
[diagram p1: MD015A_Hardware.SchDoc]

### Parts
!PCB1  Printed Circuit Board  (value not drawn)  (mechanical)
FID1  Fiducial  [Fiducial10-20]  (value not drawn)
FID2  Fiducial  [Fiducial10-20]  (value not drawn)
FID3  Fiducial  [Fiducial10-20]  (value not drawn)
H1  NY PMS 440 0025 PH  [NY PMS 440 0025 PH]  (value not drawn)
H2  NY PMS 440 0025 PH  [NY PMS 440 0025 PH]  (value not drawn)
H3  NY PMS 440 0025 PH  [NY PMS 440 0025 PH]  (value not drawn)
H4  NY PMS 440 0025 PH  [NY PMS 440 0025 PH]  (value not drawn)
H5  1902C  [Keystone_1902C]  (value not drawn)
H6  1902C  [Keystone_1902C]  (value not drawn)
H7  1902C  [Keystone_1902C]  (value not drawn)
H8  1902C  [Keystone_1902C]  (value not drawn)
LBL1  THT-14-423-10  Note: Size: 0.65" x 0.20 "  [Label_650x200]
LOGO1  WEEE logo  [WEEE_Minimum]  (no BOM)
Logo2  CE Mark  [CE_Mark_5mm]  (no BOM)
Logo3  Texas Instruments  [TI_Horizontal_Overlay_Small]  (no BOM)
Logo4  CAUTION.  READ USER GUIDE BEFORE USE  [IEC_Caution_Small]  (no BOM)
Logo5  FCC disclaimer  [FCC_disclaimer_stacked]  (no BOM)
LOGO6  CAUTION HOT SURFACE  [IEC_HotSurface_Small]  (no BOM)
LOGO7  DANGER HIGH VOLTAGE  [IEC_HighVoltage_Small]  (no BOM)
LOGO8  DANGER HIGH VOLTAGE  [IEC_HighVoltage_Small]  (no BOM)
LOGO9  CAUTION HOT SURFACE  [IEC_HotSurface_Small]  (no BOM)
ZZ1  These assemblies must comply with workmanship standards IPC-A-610 Class 2, unless otherwise specified.  [AssemblyNote]  (no BOM)
ZZ2  These assemblies must be clean and free from flux and all contaminants. Use of no clean flux is not acceptable.  [AssemblyNote]  (no BOM)
ZZ3  These assemblies are ESD sensitive, ESD precautions shall be observed.  [AssemblyNote]  (no BOM)
ZZ4  This Assembly Note is for PCB labels only  [AssemblyNoteLabel]  (no BOM)

### Nets

Not connected (* = marked no-connect by the designer): H1 1; H2 1; H3 1; H4 1

### Notes on the sheet
- Variant
- Variant/Label Table
- Label Text
- 001
- 002
- DRV8350S-EVM
- DRV8350H-EVM
- Drawn By:
- SVN Rev:
- Number:
- TID #:
- Orderable:
- Rev:
- Sheet Title:
- File:
- Project Title:
- Designed for:
- Assembly Variant:
- Mod. Date:
- Sheet:
- Size:
- of
- B
- http://www.ti.com
- Texas Instruments and/or its licensors do not warrant the accuracy or completeness of this specification or any information contained therein. Texas Instruments and/or its licensors do not warrant that this design will meet the specifications, will be suitable for your application or fit for any particular purpose, or will operate in an implementation. Texas Instruments and/or its licensors do not warrant that the design is production worthy. You should completely validate and test your design implementation to confirm the system functionality for your application.
- Engineer:
- Contact:
- © Texas Instruments
- (in symbol CMP-0003616-3) Label Assembly Note
- (in symbol CMP-0003618-2) PCB Number:; PCB Rev:
- (in symbol CMP-0003625-1) PCB Label
- (in symbol CMP-0074769-1) PCB; LOGO
- (in symbol CMP-0074836-1) PCB; LOGO
- (in symbol CMP-0074838-1) PCB; LOGO
- (in symbol CMP-0074847-1) PCB; LOGO

### Library data of the parts
!PCB1 = CMP-0003618-2: Manufacturer: Any; PartNumber: MD015; CompType: PCB; RoHS: O; MountType: N/A; Publisher: Texas Instruments; LatestRevisionDate: 2017-03-09; Key: PCB
FID1-FID3 = CMP-0077181-1: Fiducial mark.  There is nothing to buy or mount.; CompType: Fiducial; Manufacturer: N/A; MountType: N/A; PackageReference: N/A; PartNumber: N/A; ClassName: FiducialMark; Library Reference: Fiducial
H1-H4 = CMP-0003617-1: Machine Screw, Round, #4-40 x 1/4, Nylon, Philips panhead; Manufacturer: B&F Fastener Supply; CompType: Hardware; MountType: N/A; RoHS: Y; PartNumber: NY PMS 440 0025 PH; PackageReference: Screw; ComponentLink1Description: Datasheet Link; ComponentLink1URL: http://www.fasnetdirect.com/refguide/Nylpanms.pdf; ClassName: Mounting Holes; LatestRevisionDate: 2017-03-09; Publisher: Texas Instruments; Supplier 1: Digi-Key; Supplier Part Number 1: H542-ND; Key: NY PMS 440 0025 PH
H5-H8 = CMP-0003610-1: Standoff, Hex, 0.5"L #4-40 Nylon; Manufacturer: Keystone; CompType: Hardware; MountType: N/A; RoHS: Y; PartNumber: 1902C; PackageReference: Standoff; ComponentLink1Description: Datasheet Link; ComponentLink1URL: http://www.keyelco.com/pdfs/M55-prod31.pdf; LatestRevisionDate: 2017-03-09; Publisher: Texas Instruments; Supplier 1: Digi-Key; Supplier Part Number 1: 36-1902C-ND; Key: 1902C
LBL1 = CMP-0003625-1: Thermal Transfer Printable Labels, 0.650" W x 0.200" H - 10,000 per roll; Manufacturer: Brady; ClassName: Label; CompType: Label; PartNumber: THT-14-423-10; RoHS: Y; PackageReference: PCB Label 0.650 x 0.200 inch; MountType: N/A; ComponentLink1Description: Web Page; ComponentLink1URL: http://www.bradyid.com/bradyid/pdpv/THT-14-423-10.html; Publisher: Texas Instruments; LatestRevisionDate: 2017-03-09; Supplier 1: Newark; Supplier Part Number 1: 97C5133; Supplier 2: Farnell; Supplier Part Number 2: 2065596; Key: THT-14-423-10
LOGO1 = CMP-0074769-1: Library Reference: WEEE logo; Lib Reference: WEEE logo; PartNumber: WEEE logo
Logo2 = CMP-0074844-1: SymbolCreator: a0412235; Published: 2009-03-03; Publisher: Texas Instruments; LatestRevisionDate: 2017-07-06; Lib Reference: CE Mark; PartNumber: CE Mark; Library Reference: CE Mark
Logo3 = CMP-0074838-1: Texas Instrument Corporate Signature; SymbolCreator: a0412235; Lib Reference: TI_Logo; SymbolVersion: 2011-08-22; Published: 2009-03-03; Publisher: Texas Instruments; ClassName: Logo; LatestRevisionDate: 2017-07-06; PartNumber: Texas Instruments; Library Reference: Logo
Logo4 = CMP-0074836-1: IEC 61010-1 Caution Warning; SymbolCreator: a0412235; Lib Reference: IEC_Caution; Library Reference: Logo; Publisher: Texas Instruments; SymbolVersion: 2011-08-22; Published: 2009-03-03; LatestRevisionDate: 2017-07-06; PartNumber: CAUTION.  READ USER GUIDE BEFORE USE
Logo5 = CMP-0074847-1: FCC_disclaimer; Published: 2009-03-03; Publisher: Texas Instruments; LatestRevisionDate: 2017-07-06; Lib Reference: FCC_disclaimer; PartNumber: FCC disclaimer; Library Reference: Logo
LOGO6 LOGO9 = CMP-0074837-1: IEC 61010-1 Hot Surface Warning; SymbolCreator: a0412235; SymbolVersion: 2011-08-22; Published: 2009-03-03; Publisher: Texas Instruments; LatestRevisionDate: 2017-07-06; Lib Reference: IEC_HotSurface; PartNumber: CAUTION HOT SURFACE; Library Reference: IEC_HotSurface
LOGO7 LOGO8 = CMP-0074835-1: IEC 61010-1 High Voltage Warning; SymbolCreator: a0412235; SymbolVersion: 2011-08-22; Published: 2009-03-03; Publisher: Texas Instruments; LatestRevisionDate: 2017-07-06; Lib Reference: IEC_HighVoltage; PartNumber: DANGER HIGH VOLTAGE; Library Reference: IEC_HighVoltage
ZZ1 = CMP-0077238-1: CompType: AssemblyNote; ClassName: AssemblyNote; Publisher: Texas Instruments; LatestRevisionDate: 2017-08-10; Key: AssemblyNote
ZZ2 = CMP-0077237-1: CompType: AssemblyNote; ClassName: AssemblyNote; Publisher: Texas Instruments; LatestRevisionDate: 2017-08-10; Key: AssemblyNote
ZZ3 = CMP-0077236-1: CompType: AssemblyNote; ClassName: AssemblyNote; Publisher: Texas Instruments; LatestRevisionDate: 2017-08-10; Key: AssemblyNote
ZZ4 = CMP-0003616-3: CompType: AssemblyNote; ClassName: AssemblyNote; Publisher: Texas Instruments; LatestRevisionDate: 2017-03-09; Key: AssemblyNoteLabel